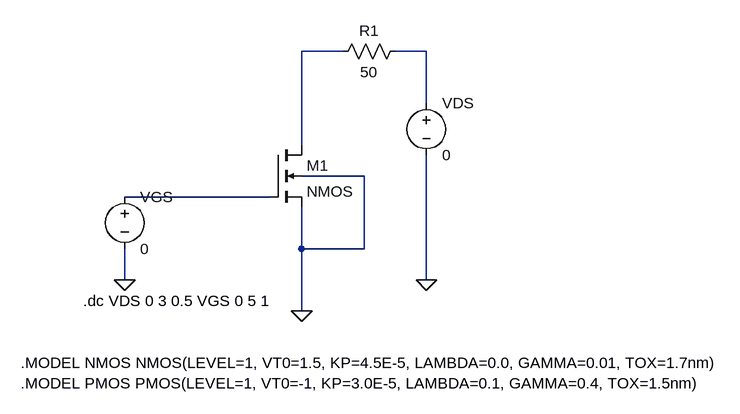
[diagram p0: schematic IV-nmos.asc]
IV-nmos.asc, the LTspice schematic file:
Version 4
SHEET 1 1460 680
WIRE 336 -112 272 -112
WIRE 464 -112 416 -112
WIRE 464 -32 464 -112
WIRE 272 32 272 -112
WIRE 368 80 272 80
WIRE 224 112 0 112
WIRE 272 192 272 128
WIRE 368 192 368 80
WIRE 368 192 272 192
WIRE 0 240 0 192
WIRE 464 240 464 48
WIRE 272 288 272 192
FLAG 272 288 0
FLAG 0 240 0
FLAG 464 240 0
SYMBOL voltage 0 96 R0
SYMATTR InstName VGS
SYMATTR Value 0
SYMBOL voltage 464 -48 R0
SYMATTR InstName VDS
SYMATTR Value 0
SYMBOL nmos4 224 32 R0
SYMATTR InstName M1
SYMBOL res 432 -128 R90
WINDOW 0 0 56 VBottom 2
WINDOW 3 32 56 VTop 2
SYMATTR InstName R1
SYMATTR Value 50
TEXT -64 272 Left 2 !.dc VDS 0 3 0.5 VGS 0 5 1
TEXT -160 368 Left 2 !.MODEL NMOS NMOS(LEVEL=1, VT0=1.5, KP=4.5E-5, LAMBDA=0.0, GAMMA=0.01, TOX=1.7nm)\n.MODEL PMOS PMOS(LEVEL=1, VT0=-1, KP=3.0E-5, LAMBDA=0.1, GAMMA=0.4, TOX=1.5nm)

The netlist it stands for:
* IV-nmos.asc
VGS N003 0 0
VDS N002 0 0
M1 N001 N003 0 0 NMOS
R1 N002 N001 50
.model NMOS NMOS
.model PMOS PMOS
.lib standard.mos
.dc VDS 0 3 0.5 VGS 0 5 1
.MODEL NMOS NMOS(LEVEL=1, VT0=1.5, KP=4.5E-5, LAMBDA=0.0, GAMMA=0.01, TOX=1.7nm)
.MODEL PMOS PMOS(LEVEL=1, VT0=-1, KP=3.0E-5, LAMBDA=0.1, GAMMA=0.4, TOX=1.5nm)
.backanno
.end